# Altium project ESP32.PrjPcb
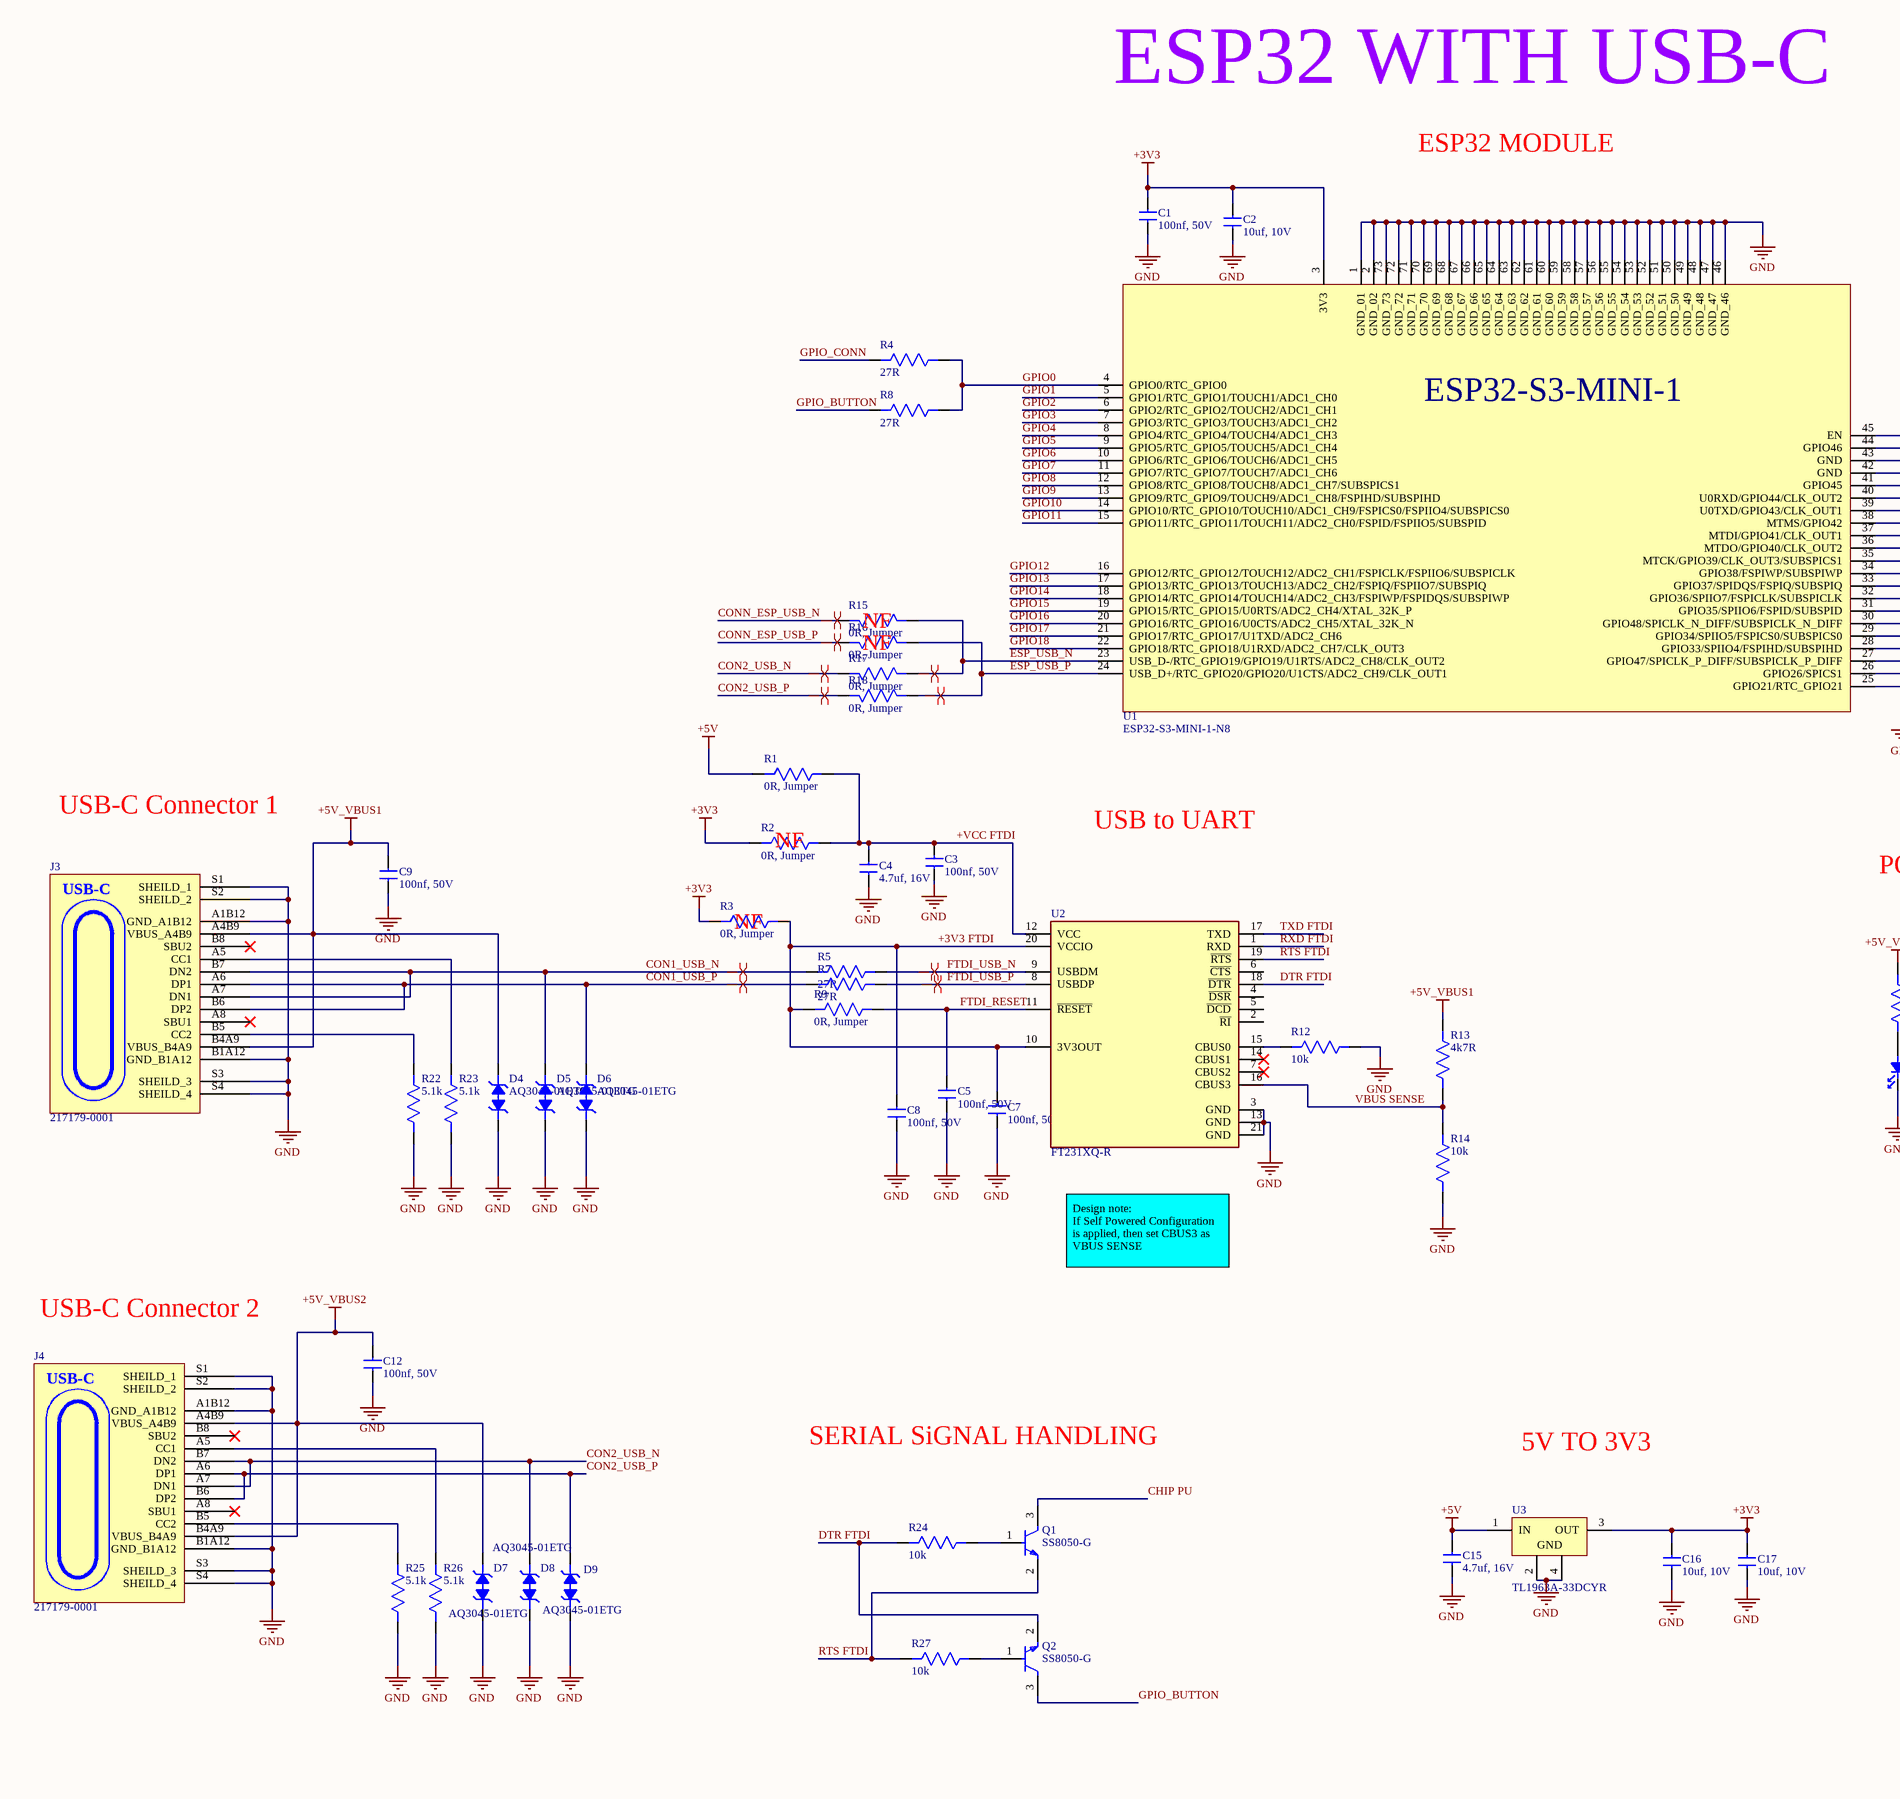
[diagram p0: ESP32_USBC.SchDoc, left]
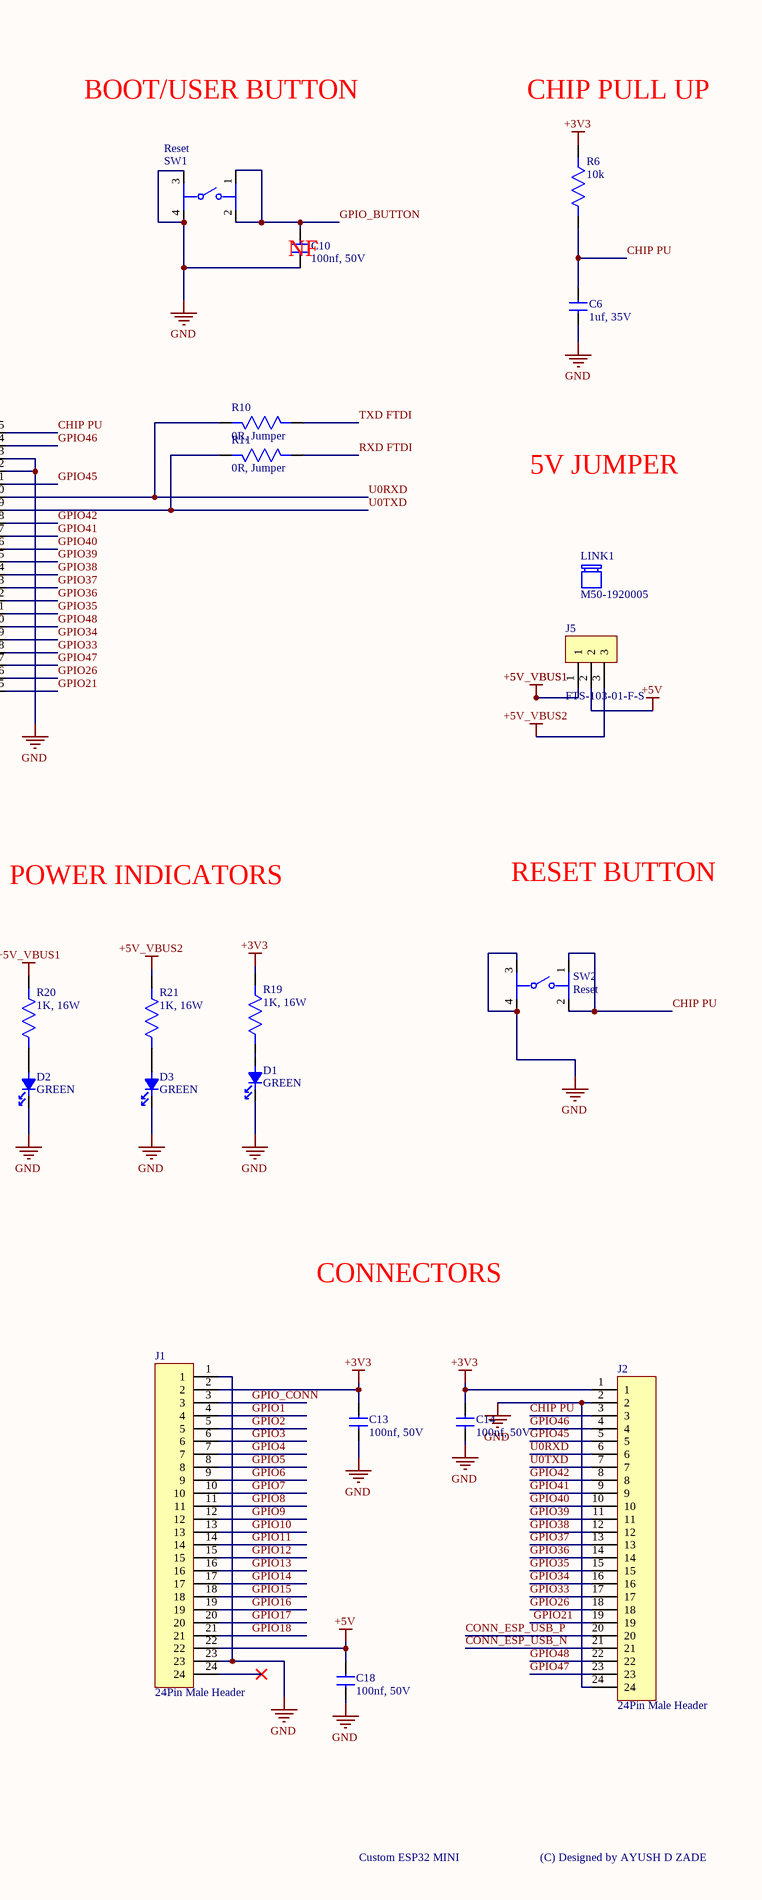
[diagram p1: ESP32_USBC.SchDoc, right]
1 sheet, 66 parts. Net scope: global (net labels, ports and power ports of the same name join across sheets).
Board file: ESP32_USBCv1.PcbDoc

## Sheet ESP32_USBC.SchDoc
size A2; SheetNumber: 1; SheetTotal: 1

### Parts
C1  100nf, 50V  [CAPC1005X70N]
C2  10uf, 10V  [CAPC1005X70N]
C3  100nf, 50V  [CAPC1005X70N]
C4  4.7uf, 16V  [CAPC1005X70N]
C5  100nf, 50V  [CAPC1005X70N]
C6  1uf, 35V  [CAPC1005X70N]
C7  100nf, 50V  [CAPC1005X70N]
C8  100nf, 50V  [CAPC1005X70N]
C9  100nf, 50V  [CAPC1005X70N]
C10  100nf, 50V  [CAPC1005X70N]
C12  100nf, 50V  [CAPC1005X70N]
C13  100nf, 50V  [CAPC1005X70N]
C14  100nf, 50V  [CAPC1005X70N]
C15  4.7uf, 16V  [CAPC1005X70N]
C16  10uf, 10V  [CAPC1005X70N]
C17  10uf, 10V  [CAPC1005X70N]
C18  100nf, 50V  [CAPC1005X70N]
D1  GREEN  [LEDC1005X35N]
D2  GREEN  [LEDC1005X35N]
D3  GREEN  [LEDC1005X35N]
D4  AQ3045-01ETG  [SOD882]
D5  AQ3045-01ETG  [SOD882]
D6  AQ3045-01ETG  [SOD882]
D7  AQ3045-01ETG  [SOD882]
D8  AQ3045-01ETG  [SOD882]
D9  AQ3045-01ETG  [SOD882]
J1  24Pin Male Header  [HDR_01x24_2.54mm]
J2  24Pin Male Header  [HDR_01x24_2.54mm]
J3  217179-0001  [FP-2171790001-MFG]
J4  217179-0001  [FP-2171790001-MFG]
J5  FTS-103-01-F-S  [HDR_01x03_1.27]
LINK1  M50-1920005  (mechanical)
Q1  SS8050-G  [FP-SS8050-G-IPC_B]
Q2  SS8050-G  [FP-SS8050-G-IPC_B]
R1  0R, Jumper  [RESC1005X37N]
R2  0R, Jumper  [RESC1005X37N]
R3  0R, Jumper  [RESC1005X37N]
R4  27R  [RESC1005X37N]
R5  27R  [RESC1005X37N]
R6  10k  [RESC1005X37N]
R7  27R  [RESC1005X37N]
R8  27R  [RESC1005X37N]
R9  0R, Jumper  [RESC1005X37N]
R10  0R, Jumper  [RESC1005X37N]
R11  0R, Jumper  [RESC1005X37N]
R12  10k  [RESC1005X37N]
R13  4k7R  [RESC1005X37N]
R14  10k  [RESC1005X37N]
R15  0R, Jumper  [RESC1005X37N]
R16  0R, Jumper  [RESC1005X37N]
R17  0R, Jumper  [RESC1005X37N]
R18  0R, Jumper  [RESC1005X37N]
R19  1K, 16W  [RESC1005X37N]
R20  1K, 16W  [RESC1005X37N]
R21  1K, 16W  [RESC1005X37N]
R22  5.1k  [RESC1005X37N]
R23  5.1k  [RESC1005X37N]
R24  10k  [RESC1005X37N]
R25  5.1k  [RESC1005X37N]
R26  5.1k  [RESC1005X37N]
R27  10k  [RESC1005X37N]
SW1  Reset  [FP-PTS645SH50SMTR92LFS-MFG]
SW2  Reset  [FP-PTS645SH50SMTR92LFS-MFG]
U1  ESP32-S3-MINI-1-N8  [XCVR_ESP32-S3-MINI-1-N8]
U2  FT231XQ-R  [FP-QFN-20-IPC_B]
U3  TL1963A-33DCYR  [DCY0004A_N]

### Nets
+3V3: C1.2 C2.2 C13.2 C14.2 C16.2 C17.2 J1.2 J2.1 R2.1 R3.1 R6.2 R19.2 U1.3(3V3) U3.3(OUT)
+5V: C15.2 C18.2 J1.22 J5.2 R1.1 U3.1(IN)
+5V_VBUS1: C9.2 D4.2 J3.A4B9(VBUS_A4B9) J3.B4A9(VBUS_B4A9) J5.1 R13.2 R20.2
+5V_VBUS2: C12.2 D7.2 J4.A4B9(VBUS_A4B9) J4.B4A9(VBUS_B4A9) J5.3 R21.2
GND: C1.1 C2.1 C3.1 C4.1 C5.1 C6.1 C7.1 C8.1 C9.1 C10.2 C12.1 C13.1 C14.1 C15.1 C16.1 C17.1 C18.1 D1.1 D2.1 D3.1 D4.1 D5.1 D6.1 D7.1 D8.1 D9.1 J1.1 J1.23 J2.2 J2.24 J3.A1B12(GND_A1B12) J3.B1A12(GND_B1A12) J3.S1(SHEILD_1) J3.S2(SHEILD_2) J3.S3(SHEILD_3) J3.S4(SHEILD_4) J4.A1B12(GND_A1B12) J4.B1A12(GND_B1A12) J4.S1(SHEILD_1) J4.S2(SHEILD_2) J4.S3(SHEILD_3) J4.S4(SHEILD_4) R12.2 R14.1 R22.2 R23.2 R25.2 R26.2 SW1.3 SW1.4 SW2.3 SW2.4 U1.1(GND_01) U1.2(GND_02) U1.42(GND) U1.43(GND) U1.46(GND_46) U1.47(GND_47) U1.48(GND_48) U1.49(GND_49) U1.50(GND_50) U1.51(GND_51) U1.52(GND_52) U1.53(GND_53) U1.54(GND_54) U1.55(GND_55) U1.56(GND_56) U1.57(GND_57) U1.58(GND_58) U1.59(GND_59) U1.60(GND_60) U1.61(GND_61) U1.62(GND_62) U1.63(GND_63) U1.64(GND_64) U1.65(GND_65) U1.66(GND_66) U1.67(GND_67) U1.68(GND_68) U1.69(GND_69) U1.70(GND_70) U1.71(GND_71) U1.72(GND_72) U1.73(GND_73) U2.3(GND) U2.13(GND) U2.21(GND) U3.2(GND) U3.4(GND)
+3V3 FTDI: C7.2 C8.2 R3.2 R9.1 U2.10(3V3OUT) U2.20(VCCIO)
+VCC FTDI: C3.2 C4.2 R1.2 R2.2 U2.12(VCC)
CHIP PU: C6.2 J2.3 Q1.3(C) R6.1 SW2.1 SW2.2 U1.45(EN)
CON1_USB_N: D5.2 J3.A7(DN1) J3.B7(DN2) R5.1
CON1_USB_P: D6.2 J3.A6(DP1) J3.B6(DP2) R7.1
CON2_USB_N: D8.2 J4.A7(DN1) J4.B7(DN2) R17.2
CON2_USB_P: D9.2 J4.A6(DP1) J4.B6(DP2) R18.2
CONN_ESP_USB_N: J2.21 R15.2
CONN_ESP_USB_P: J2.20 R16.2
DTR FTDI: Q2.2(E) R24.1 U2.18(~{DTR})
ESP_USB_N: R15.1 R17.1 U1.23(USB_D-/RTC_GPIO19/GPIO19/U1RTS/ADC2_CH8/CLK_OUT2)
ESP_USB_P: R16.1 R18.1 U1.24(USB_D+/RTC_GPIO20/GPIO20/U1CTS/ADC2_CH9/CLK_OUT1)
FTDI_RESET: C5.2 R9.2 U2.11(~{RESET})
FTDI_USB_N: R5.2 U2.9(USBDM)
FTDI_USB_P: R7.2 U2.8(USBDP)
GPIO0: R4.2 R8.2 U1.4(GPIO0/RTC_GPIO0)
GPIO1: J1.4 U1.5(GPIO1/RTC_GPIO1/TOUCH1/ADC1_CH0)
GPIO2: J1.5 U1.6(GPIO2/RTC_GPIO2/TOUCH2/ADC1_CH1)
GPIO3: J1.6 U1.7(GPIO3/RTC_GPIO3/TOUCH3/ADC1_CH2)
GPIO4: J1.7 U1.8(GPIO4/RTC_GPIO4/TOUCH4/ADC1_CH3)
GPIO5: J1.8 U1.9(GPIO5/RTC_GPIO5/TOUCH5/ADC1_CH4)
GPIO6: J1.9 U1.10(GPIO6/RTC_GPIO6/TOUCH6/ADC1_CH5)
GPIO7: J1.10 U1.11(GPIO7/RTC_GPIO7/TOUCH7/ADC1_CH6)
GPIO8: J1.11 U1.12(GPIO8/RTC_GPIO8/TOUCH8/ADC1_CH7/SUBSPICS1)
GPIO9: J1.12 U1.13(GPIO9/RTC_GPIO9/TOUCH9/ADC1_CH8/FSPIHD/SUBSPIHD)
GPIO10: J1.13 U1.14(GPIO10/RTC_GPIO10/TOUCH10/ADC1_CH9/FSPICS0/FSPIIO4/SUBSPICS0)
GPIO11: J1.14 U1.15(GPIO11/RTC_GPIO11/TOUCH11/ADC2_CH0/FSPID/FSPIIO5/SUBSPID)
GPIO12: J1.15 U1.16(GPIO12/RTC_GPIO12/TOUCH12/ADC2_CH1/FSPICLK/FSPIIO6/SUBSPICLK)
GPIO13: J1.16 U1.17(GPIO13/RTC_GPIO13/TOUCH13/ADC2_CH2/FSPIQ/FSPIIO7/SUBSPIQ)
GPIO14: J1.17 U1.18(GPIO14/RTC_GPIO14/TOUCH14/ADC2_CH3/FSPIWP/FSPIDQS/SUBSPIWP)
GPIO15: J1.18 U1.19(GPIO15/RTC_GPIO15/U0RTS/ADC2_CH4/XTAL_32K_P)
GPIO16: J1.19 U1.20(GPIO16/RTC_GPIO16/U0CTS/ADC2_CH5/XTAL_32K_N)
GPIO17: J1.20 U1.21(GPIO17/RTC_GPIO17/U1TXD/ADC2_CH6)
GPIO18: J1.21 U1.22(GPIO18/RTC_GPIO18/U1RXD/ADC2_CH7/CLK_OUT3)
GPIO21: J2.19 U1.25(GPIO21/RTC_GPIO21)
GPIO26: J2.18 U1.26(GPIO26/SPICS1)
GPIO33: J2.17 U1.28(GPIO33/SPIIO4/FSPIHD/SUBSPIHD)
GPIO34: J2.16 U1.29(GPIO34/SPIIO5/FSPICS0/SUBSPICS0)
GPIO35: J2.15 U1.31(GPIO35/SPIIO6/FSPID/SUBSPID)
GPIO36: J2.14 U1.32(GPIO36/SPIIO7/FSPICLK/SUBSPICLK)
GPIO37: J2.13 U1.33(GPIO37/SPIDQS/FSPIQ/SUBSPIQ)
GPIO38: J2.12 U1.34(GPIO38/FSPIWP/SUBSPIWP)
GPIO39: J2.11 U1.35(MTCK/GPIO39/CLK_OUT3/SUBSPICS1)
GPIO40: J2.10 U1.36(MTDO/GPIO40/CLK_OUT2)
GPIO41: J2.9 U1.37(MTDI/GPIO41/CLK_OUT1)
GPIO42: J2.8 U1.38(MTMS/GPIO42)
GPIO45: J2.5 U1.41(GPIO45)
GPIO46: J2.4 U1.44(GPIO46)
GPIO47: J2.23 U1.27(GPIO47/SPICLK_P_DIFF/SUBSPICLK_P_DIFF)
GPIO48: J2.22 U1.30(GPIO48/SPICLK_N_DIFF/SUBSPICLK_N_DIFF)
GPIO_BUTTON: C10.1 Q2.3(C) R8.1 SW1.1 SW1.2
GPIO_CONN: J1.3 R4.1
RTS FTDI: Q1.2(E) R27.1 U2.19(~{RTS})
RXD FTDI: R11.1 U2.1(RXD)
TXD FTDI: R10.1 U2.17(TXD)
U0RXD: J2.6 R10.2 U1.40(U0RXD/GPIO44/CLK_OUT2)
U0TXD: J2.7 R11.2 U1.39(U0TXD/GPIO43/CLK_OUT1)
VBUS SENSE: R13.1 R14.2 U2.16(CBUS3)
NetD1_2: D1.2 R19.1
NetD2_2: D2.2 R20.1
NetD3_2: D3.2 R21.1
NetJ3_A5: J3.A5(CC1) R23.1
NetJ3_B5: J3.B5(CC2) R22.1
NetJ4_A5: J4.A5(CC1) R26.1
NetJ4_B5: J4.B5(CC2) R25.1
NetQ1_1: Q1.1(B) R24.2
NetQ2_1: Q2.1(B) R27.2
NetR12_1: R12.1 U2.15(CBUS0)

Not connected (* = marked no-connect by the designer): J1 24*; J3 A8(SBU1)* B8(SBU2)*; J4 A8(SBU1)* B8(SBU2)*; U2 2(~{RI}) 4(~{DSR}) 5(~{DCD}) 6(~{CTS}) 7(CBUS2)* 14(CBUS1)*

### Layout directives
differential pair; differential pair class DIFF90: CON1_USB_N, CON1_USB_P, CON2_USB_N, CON2_USB_P, CONN_ESP_USB_N, CONN_ESP_USB_P, ESP_USB_N, ESP_USB_P, FTDI_USB_N, FTDI_USB_P

### Notes on the sheet
- ESP32 WITH USB-C
- BOOT/USER BUTTON
- CHIP PULL UP
- ESP32 MODULE
- (near C10) NF
- 5V JUMPER
- (near R15) NF
- (near R16) NF
- USB-C Connector 1
- (near R2) NF
- USB to UART
- POWER INDICATORS
- RESET BUTTON
- (near R3) NF
- Design note:
  If Self Powered Configuration is applied, then set CBUS3 as VBUS SENSE
- CONNECTORS
- USB-C Connector 2
- SERIAL SiGNAL HANDLING
- 5V TO 3V3
- Custom ESP32 MINI
- (C) Designed by AYUSH D ZADE
- (in symbol 217179-0001) USB-C
- (in symbol ESP32-S3-MINI-1-N8) ESP32-S3-MINI-1

### Library data of the parts
C1 C3 C5 C7-C10 C12-C14 C18 = CL05B104KB5NNWC: CAP CER 0.1UF 50V X7R 0402; Manufacturer: Samsung Electro-Mechanics; Dielectric Material: Ceramic; Supplier: DigiKey; Supplier Part Number: 1276-CL05B104KB5NNWCDKR-ND; Manufacturer Part Number: CL05B104KB5NNWC; RoHS: Compliant; Category: Ceramic Capacitors; Stock: 37619; Pricing: 1=0.1, 10=0.054, 100=0.0322, 1000=0.02094, 2500=0.01816, 5000=0.01649 (USD); Value: 100nF; China RoHS: Compliant; Lifecycle Status: Production; Max Operating Temperature: 125°C; Min Operating Temperature: -55°C; Mounting Technology: Surface Mount; Number of Terminals: 2; REACH SVHC: Yes; Schedule B: 8532240020, 8532240020|8532240020|8532240020|8532240020|8532240020; Voltage Rating (DC): 50V; ComponentLink1URL: https://datasheet.octopart.com:443/CL05B104KB5NNWC-Samsung-Electro-Mechanics-datasheet-182018729.pdf?src-supplier=IHS; ComponentLink1Description: https://datasheet.octopart.com:443/CL05B104KB5NNWC-Samsung-Electro-Mechanics-datasheet-182018729.pdf?src-supplier=IHS; LCSC Part No.: C7229230
C2 C16 C17 = CL05A106MP5NRNC: CAP CER 10UF 10V X5R 0402; Manufacturer: Samsung Electro-Mechanics; Value: 10µF; Dielectric Material: Ceramic; Tolerance: 20%; Supplier: DigiKey; Supplier Part Number: 1276-CL05A106MP5NRNCCT-ND; Manufacturer Part Number: CL05A106MP5NRNC; RoHS: Compliant; Category: Ceramic Capacitors; Stock: 49277; Pricing: 1=0.24, 10=0.141, 100=0.0894, 1000=0.06284, 2500=0.05624, 5000=0.05227 (USD); Case/Package: 0402; China RoHS: Compliant; Height: 550µm; Lifecycle Status: NRND; Material: Ceramic; Max Operating Temperature: 85°C; Min Operating Temperature: -55°C; Mounting Technology: Surface Mount; Number of Terminals: 2; REACH SVHC: Yes; Voltage Rating: 10V; Voltage Rating (DC): 10V; ComponentLink1URL: https://datasheet.octopart.com:443/CL05A106MP5NRNC-Samsung-Electro-Mechanics-datasheet-182018592.pdf?src-supplier=IHS; ComponentLink1Description: https://datasheet.octopart.com:443/CL05A106MP5NRNC-Samsung-Electro-Mechanics-datasheet-182018592.pdf?src-supplier=IHS; ComponentLink2URL: https://datasheet.octopart.com:443/CL05A106MP5NRNC-Samsung-Electro-Mechanics-datasheet-141346812.pdf?src-supplier=Samsung+SCT; ComponentLink2Description: https://datasheet.octopart.com:443/CL05A106MP5NRNC-Samsung-Electro-Mechanics-datasheet-141346812.pdf?src-supplier=Samsung+SCT; LCSC Part No.: C3035383
C4 C15 = CL05A475MO5NUNC: 4.7 µF ±20% 16V Ceramic Capacitor X5R 0402 (1005 Metric); Manufacturer: Samsung; Multilayer: Yes; Supplier: Digikey; Supplier Part Number: 1276-6836-1-ND; Manufacturer Part Number: CL05A475MO5NUNC; RoHS: Yes; Category: Ceramic Capacitors; Pricing: 1=0.15, 10=0.091, 100=0.0842 (USD); Mounting Technology: Surface Mount; Pins: 2; Dielectric Material: Ceramic; Package Shape: Rectangular; Case/Package: 0402; Terminal Finish: Nickel; Min Operating Temperature: -55°C; Max Operating Temperature: 85°C; JESD-609 Code: e3; Value: 4.7uF; Capacitor Type: Ceramic; Tolerance  (fill in as +-): 20%; Package Style: SMTMeter; Packaging: Tape and Reel; Tolerance (fill in as +-): 20%; Rated DC Voltage (URdc): 16V; Temperature Characteristics Code: X5R; Termination: Wraparound; Length: 1mm; Width: 0.5mm; Height: 0.7mm; Reach SVHC Compliant: Yes; RoHS Compliant: Yes; ComponentLink1URL: https://datasheet.ciiva.com:443/pdfs/VipMasterIC/IC/SEMS/SEMS-S-A0008384515/SEMS-S-A0008898881-1.pdf?src-supplier=IHS+Markit; ComponentLink1Description: https://datasheet.ciiva.com:443/pdfs/VipMasterIC/IC/SEMS/SEMS-S-A0008384515/SEMS-S-A0008898881-1.pdf?src-supplier=IHS+Markit; ComponentLink2URL: http://www.farnell.com/datasheets/2710653.pdf?src-supplier=Farnell; ComponentLink2Description: http://www.farnell.com/datasheets/2710653.pdf?src-supplier=Farnell; ComponentLink3URL: http://www.samsungsem.com/kr/support/product-search/mlcc/CL05A475MO5NUNC.jsp?src-supplier=Digikey; ComponentLink3Description: http://www.samsungsem.com/kr/support/product-search/mlcc/CL05A475MO5NUNC.jsp?src-supplier=Digikey; ComponentLink4URL: http://www.farnell.com/datasheets/2710653.pdf?src-supplier=Newark; ComponentLink4Description: http://www.farnell.com/datasheets/2710653.pdf?src-supplier=Newark; ComponentLink5URL: http://www.farnell.com/datasheets/2710653.pdf?src-supplier=Element14; ComponentLink5Description: http://www.farnell.com/datasheets/2710653.pdf?src-supplier=Element14; ComponentLink6URL: https://datasheet.octopart.com/CL05A475MO5NUNC-Samsung-Electro-Mechanics-datasheet-123102911.pdf?src-supplier=Future+Electronics; ComponentLink6Description: https://datasheet.octopart.com/CL05A475MO5NUNC-Samsung-Electro-Mechanics-datasheet-123102911.pdf?src-supplier=Future+Electronics; LCSC Part No.: C318563
C6 = CL05A105KL5NRNC: CAP CER 1UF 35V X5R 0402; Manufacturer: Samsung Electro-Mechanics; Value: 1µF; Dielectric Material: Ceramic; Tolerance: 10%; Supplier: DigiKey; Supplier Part Number: 1276-6796-1-ND; Manufacturer Part Number: CL05A105KL5NRNC; RoHS: Compliant; Category: Ceramic Capacitors; Stock: 53917; Pricing: 1=0.29, 10=0.17, 100=0.1097, 1000=0.07829, 2500=0.07048, 5000=0.06578 (USD); Case/Package: 0402; Case Code (Imperial): 0402; Case Code (Metric): 1005; China RoHS: Compliant; Height: 550µm; Length: 990.6µm; Lifecycle Status: Production; Material: Ceramic; Max Operating Temperature: 85°C; Min Operating Temperature: -55°C; Mounting Technology: Surface Mount; Number of Terminals: 2; REACH SVHC: Yes; Schedule B: 8532240020, 8532240020|8532240020|8532240020|8532240020|8532240020; Thickness: 558.8µm; Voltage Rating: 35V; Voltage Rating (DC): 35V; Width: 508µm; ComponentLink1URL: https://datasheet.octopart.com:443/CL05A105KL5NRNC-Samsung-Electro-Mechanics-datasheet-182018568.pdf?src-supplier=IHS; ComponentLink1Description: https://datasheet.octopart.com:443/CL05A105KL5NRNC-Samsung-Electro-Mechanics-datasheet-182018568.pdf?src-supplier=IHS; ComponentLink2URL: https://datasheet.octopart.com:443/CL05A105KL5NRNC-Samsung-Electro-Mechanics-datasheet-141346806.pdf?src-supplier=Samsung+SCT; ComponentLink2Description: https://datasheet.octopart.com:443/CL05A105KL5NRNC-Samsung-Electro-Mechanics-datasheet-141346806.pdf?src-supplier=Samsung+SCT; ComponentLink3URL: https://datasheet.octopart.com:443/CL05A105KL5NRNC-Samsung-datasheet-8326407.pdf?src-supplier=TME; ComponentLink3Description: https://datasheet.octopart.com:443/CL05A105KL5NRNC-Samsung-datasheet-8326407.pdf?src-supplier=TME; LCSC Part No.: C307413
D1-D3 = VLMG1500-GS08: LED YLW-GRN 0402 SMD; Manufacturer: Vishay; Color: Green,Yellow; Shape: Rectangular; Forward Current: 30mA; Forward Voltage: 2.4V; Luminous Intensity-Nom: 90mcd; Channels: 1; Optoelectronic Device Type: SINGLE COLOR LED; Reverse Voltage-Max: 5V; Viewing Angle: 130°; Overall Height: 0.35mm; Supplier: Digikey; Supplier Part Number: VLMG1500-GS08CT-ND; Manufacturer Part Number: VLMG1500-GS08; RoHS: Yes; Category: LEDs; Stock: 234660; Pricing: 1=0.24, 10=0.164, 100=0.1147, 500=0.09218, 1000=0.0847 (USD); Mounting Technology: Surface Mount; Pins: 2; Color@wavelength: Green; Min Operating Temperature: -30°C; Max Operating Temperature: 85°C; Packaging: Tape and Reel; Size: 0.5mm; Terminal Pitch: 0.95mm; Reach SVHC Compliant: Yes; RoHS Compliant: Yes; ComponentLink1URL: https://datasheet.ciiva.com:443/pdfs/VipMasterIC/IC/VISH/VISH-S-A0003457490/VISH-S-A0003457490-1.pdf?src-supplier=IHS+Markit; ComponentLink1Description: https://datasheet.ciiva.com:443/pdfs/VipMasterIC/IC/VISH/VISH-S-A0003457490/VISH-S-A0003457490-1.pdf?src-supplier=IHS+Markit; ComponentLink2URL: https://datasheet.ciiva.com/12071/vlmo1500-244705-12071911.pdf?src-supplier=Mouser; ComponentLink2Description: https://datasheet.ciiva.com/12071/vlmo1500-244705-12071911.pdf?src-supplier=Mouser; ComponentLink3URL: https://datasheet.ciiva.com/30005/vlmo1500-30005134.pdf?src-supplier=Avnet; ComponentLink3Description: https://datasheet.ciiva.com/30005/vlmo1500-30005134.pdf?src-supplier=Avnet; LCSC Part No.: C511404
D4-D9 = AQ3045-01ETG: TVS DIODE 5.3VWM 12VC SOD882; Manufacturer: Littelfuse; Diode Element Material: SILICON; Package Body Material: Plastic; Polarity: Bidirectional; Max Breakdown Voltage: 9V; Min Breakdown Voltage: 6.8V; Diode Type: TRANS VOLTAGE SUPPRESSOR; Non-rep Peak Rev Power Dis-Max: 40W; Number of Elements: 1; Rep Pk Reverse Voltage-Max: 5.3V; Reference Standard: AEC-Q101; Supplier: Digikey; Supplier Part Number: F9321CT-ND; Manufacturer Part Number: AQ3045-01ETG; RoHS: Yes; Category: TVS Diodes; Stock: 7460; Pricing: 1=0.45, 10=0.29, 100=0.141, 500=0.134, 1000=0.131 (USD); Pins: 2; Package Shape: Rectangular; Min Operating Temperature: -55°C; Max Operating Temperature: 150°C; Package Style: CHIP CARRIERMeter; Surface Mount: Yes; Technology: AVALANCHE; Terminal Form: No Lead; Terminal Position: BOTTOM; Reach SVHC Compliant: Yes; RoHS Compliant: Yes; ComponentLink1URL: https://datasheet.ciiva.com:443/pdfs/VipMasterIC/IC/LFSI/LFSI-S-A0007892042/LFSI-S-A0007892042-1.pdf?src-supplier=IHS+Markit; ComponentLink1Description: https://datasheet.ciiva.com:443/pdfs/VipMasterIC/IC/LFSI/LFSI-S-A0007892042/LFSI-S-A0007892042-1.pdf?src-supplier=IHS+Markit; ComponentLink2URL: https://www.littelfuse.com/~/media/electronics/datasheets/tvs_diode_arrays/littelfuse_tvs_diode_array_aq3045_datasheet.pdf.pdf?src-supplier=Digikey; ComponentLink2Description: https://www.littelfuse.com/~/media/electronics/datasheets/tvs_diode_arrays/littelfuse_tvs_diode_array_aq3045_datasheet.pdf.pdf?src-supplier=Digikey; ComponentLink3URL: http://www.littelfuse.com/~/media/electronics/datasheets/tvs_diode_arrays/littelfuse_tvs_diode_array_aq3045_datasheet.pdf.pdf?src-supplier=Digikey; ComponentLink3Description: http://www.littelfuse.com/~/media/electronics/datasheets/tvs_diode_arrays/littelfuse_tvs_diode_array_aq3045_datasheet.pdf.pdf?src-supplier=Digikey; LCSC Part No.: C3710326
J1 J2 = 0022284245: CONN HEADER VERT 24POS 2.54MM; Manufacturer: Molex; Supplier: Digikey; Supplier Part Number: 900-0022284245-ND; Manufacturer Part Number: 22-28-4245; RoHS: No; Category: Headers and Wire Housings; Stock: 1546; Pricing: 1=1.21, 10=1.024, 100=0.8699, 500=0.77638, 1000=0.73932, 5000=0.65998, 10000=0.62851 (USD); ComponentLink1URL: https://datasheet.ciiva.com/6814/022284363-sd-6814049.pdf?src-supplier=Digikey; ComponentLink1Description: https://datasheet.ciiva.com/6814/022284363-sd-6814049.pdf?src-supplier=Digikey; ComponentLink2URL: https://datasheet.ciiva.com/10075/0022284245-pcb-headers-10075617.pdf?src-supplier=Avnet; ComponentLink2Description: https://datasheet.ciiva.com/10075/0022284245-pcb-headers-10075617.pdf?src-supplier=Avnet; ComponentLink3URL: https://datasheet.ciiva.com/1433/1597854-1433759.pdf?src-supplier=Element14; ComponentLink3Description: https://datasheet.ciiva.com/1433/1597854-1433759.pdf?src-supplier=Element14; LCSC Part No.: C7145888
J3 J4 = 217179-0001: CONN RCP USB2.0 TYP C 24P SMD RA; Manufacturer: Molex; Supplier: Digikey; Supplier Part Number: 900-2171790001CT-ND; Manufacturer Part Number: 217179-0001; RoHS: No; Category: Connectors; Stock: 19261; Pricing: 1=0.83, 10=0.704, 25=0.6596, 50=0.628, 100=0.598, 250=0.56052, 500=0.53374 (USD); LCSC Part No.: C3197684
J5 = FTS-103-01-F-S: CONN HEADER VERT 3POS 1.27MM; Manufacturer: Samtec; Manufacturer Series: FTS; Connector Type: BOARD CONNECTOR; Option: General Purpose; Additional Feature: Low Profile; Filter Feature: No; Number of Rows Loaded: 1; Number of Contacts: 3; Supplier: Digikey; Supplier Part Number: 612-FTS-103-01-F-S-ND; Manufacturer Part Number: FTS-103-01-F-S; RoHS: Yes; Category: Connectors; Stock: 679; Pricing: 1=0.73, 50=0.6378, 100=0.5407, 500=0.4491, 1000=0.384 (USD); Mounting Technology: Board; Contact Material: Bronze; Contact Finish - Mating: GOLD (3) OVER NICKEL (50); Contact Finish - Termination: Matte Tin (Sn) - with Nickel (Ni) barrier; JESD-609 Code: e3; Contact Gender: Male; Mixed Contacts: No; Mounting Style: STRAIGHT; Termination: Solder; Terminal Pitch: 1.27mm; Flammability Rating: UL94 V-0; DIN Conformance: No; IEC Conformance: No; MIL Conformance: No; Reach SVHC Compliant: Yes; RoHS Compliant: Yes; ComponentLink1URL: https://datasheet.ciiva.com:443/pdfs/VipMasterIC/IC/SAMI/SAMI-S-A0001504673/SAMI-S-A0001504673-1.pdf?src-supplier=IHS+Markit; ComponentLink1Description: https://datasheet.ciiva.com:443/pdfs/VipMasterIC/IC/SAMI/SAMI-S-A0001504673/SAMI-S-A0001504673-1.pdf?src-supplier=IHS+Markit; ComponentLink2URL: http://suddendocs.samtec.com/prints/fts-1xx-xx-xx-xx-xx-mkt.pdf?src-supplier=Digikey; ComponentLink2Description: http://suddendocs.samtec.com/prints/fts-1xx-xx-xx-xx-xx-mkt.pdf?src-supplier=Digikey; ComponentLink3URL: http://www.samtec.com/documents/webfiles/pdf/FTS.pdf?src-supplier=Avnet; ComponentLink3Description: http://www.samtec.com/documents/webfiles/pdf/FTS.pdf?src-supplier=Avnet; ComponentLink4URL: https://datasheet.octopart.com/FTS-103-01-F-S-Samtec-datasheet-116535195.pdf?src-supplier=Toby+Electronics; ComponentLink4Description: https://datasheet.octopart.com/FTS-103-01-F-S-Samtec-datasheet-116535195.pdf?src-supplier=Toby+Electronics; ComponentLink5URL: https://datasheet.octopart.com/FTS-103-01-F-S-Samtec-datasheet-151470456.pdf?src-supplier=Sager+Electronics; ComponentLink5Description: https://datasheet.octopart.com/FTS-103-01-F-S-Samtec-datasheet-151470456.pdf?src-supplier=Sager+Electronics; ComponentLink6URL: https://datasheet.octopart.com/FTS-103-01-F-S-Samtec-datasheet-118493358.pdf?src-supplier=Electro+Sonic; ComponentLink6Description: https://datasheet.octopart.com/FTS-103-01-F-S-Samtec-datasheet-118493358.pdf?src-supplier=Electro+Sonic; LCSC Part No.: C3333578
LINK1 = M50-1920005: CONN SHUNT 1.27MM RED; Manufacturer: Harwin; Manufacturer Series: M50; Connector Type: Interconnection Device; Body/Shell Style: PLUG; Contact Pattern: RECTANGULAR; Contact Resistance: 20mR; Dielectric Withstanding Voltage (AC): 500V; Durability: 300Cycles; Insulation Resistance: 1GR; Number Of Connectors: 1; Rated Current (Signal): 1A; Number of Contacts: 2; Body Breadth: 0.059inch; Body Depth: 0.118inch; Body Length: 0.098inch; Mating Contact Pitch: 0.05inch; Reference Standard: UL; Reliability: COMMERCIAL; Supplier: Digikey; Supplier Part Number: 952-1727-ND; Manufacturer Part Number: M50-1920005; RoHS: Yes; Category: Headers and Wire Housings; Stock: 4313; Pricing: 1=0.33, 10=0.284, 25=0.2664, 50=0.2536, 100=0.2414, 250=0.22628, 500=0.21546, 1000=0.20516, 3000=0.18984 (USD); Contact Material: Copper Alloy; Contact Finish - Mating: AU ON NI; Contact Finish - Termination: Gold (Au); Insulation Color: Red; Insulation Material: Nylon; Min Operating Temperature: -40°C; Max Operating Temperature: 105°C; JESD-609 Code: e4; Contact Gender: Female; Mounting Style: STRAIGHT; Number of Rows Loaded: 1; Reach SVHC Compliant: Yes; RoHS Compliant: Yes; ComponentLink1URL: https://datasheet.ciiva.com:443/pdfs/VipMasterIC/IC/HRWN/HRWNS04645/HRWNS04645-1.pdf?src-supplier=IHS+Markit; ComponentLink1Description: https://datasheet.ciiva.com:443/pdfs/VipMasterIC/IC/HRWN/HRWNS04645/HRWNS04645-1.pdf?src-supplier=IHS+Markit; ComponentLink2URL: https://datasheet.ciiva.com/4573/m50-19x-350826-4573042.pdf?src-supplier=Mouser; ComponentLink2Description: https://datasheet.ciiva.com/4573/m50-19x-350826-4573042.pdf?src-supplier=Mouser; ComponentLink3URL: https://datasheet.ciiva.com/767/m50-19x-767921.pdf?src-supplier=Digikey; ComponentLink3Description: https://datasheet.ciiva.com/767/m50-19x-767921.pdf?src-supplier=Digikey; ComponentLink4URL: https://datasheet.ciiva.com/1456/m50-19x-1456640.pdf?src-supplier=Newark; ComponentLink4Description: https://datasheet.ciiva.com/1456/m50-19x-1456640.pdf?src-supplier=Newark; ComponentLink5URL: https://datasheet.ciiva.com/1412/1836978-1412125.pdf?src-supplier=Element14; ComponentLink5Description: https://datasheet.ciiva.com/1412/1836978-1412125.pdf?src-supplier=Element14; LCSC Part No.: C6985646
Q1 Q2 = SS8050-G: TRANS NPN 25V 1.5A SOT-23-3; Manufacturer: Comchip; Supplier: Digikey; Supplier Part Number: 641-1790-1-ND; Manufacturer Part Number: SS8050-G; RoHS: Yes; Category: Transistors; Stock: 81671; Pricing: 1=0.24, 10=0.148, 100=0.0921, 500=0.06754, 1000=0.05958 (USD); Reach SVHC Compliant: Yes; RoHS Compliant: Yes; ComponentLink1URL: https://datasheet.ciiva.com:443/pdfs/VipMasterIC/IC/COMC/COMC-S-A0004994192/COMC-S-A0004994192-1.pdf?src-supplier=IHS+Markit; ComponentLink1Description: https://datasheet.ciiva.com:443/pdfs/VipMasterIC/IC/COMC/COMC-S-A0004994192/COMC-S-A0004994192-1.pdf?src-supplier=IHS+Markit; ComponentLink2URL: http://www.comchiptech.com/admin/files/product/SS8050-G RevA181526.pdf?src-supplier=Digikey; ComponentLink2Description: http://www.comchiptech.com/admin/files/product/SS8050-G RevA181526.pdf?src-supplier=Digikey; LCSC Part No.: C164886
R1-R3 R9-R11 R15-R18 = RC0402FR-070RL: RES 0 OHM JUMPER 1/16W 0402; Manufacturer: Yageo; Power: 62.5mW; Rated Temperature: 70°C; Supplier: Digikey; Supplier Part Number: 311-0.0LRCT-ND; Manufacturer Part Number: RC0402FR-070RL; RoHS: Yes; Category: Chip SMD Resistors; Stock: 807815; Pricing: 1=0.1, 10=0.01, 25=0.0064, 50=0.0054, 100=0.0047, 250=0.00392, 500=0.00346, 1000=0.00304, 5000=0.0023 (USD); Mounting Technology: Surface Mount; Pins: 2; Package Shape: Rectangular; Case/Package: 0402; Terminal Finish: Nickel; Min Operating Temperature: -55°C; Max Operating Temperature: 155°C; JESD-609 Code: e3; Resistor Type: FIXED RESISTOR; Packaging: Tape and Reel; Value: 0R; Technology: METAL GLAZE/THICK FILM; Termination: Wraparound; Reach SVHC Compliant: Yes; RoHS Compliant: Yes; ComponentLink1URL: https://datasheet.ciiva.com:443/pdfs/VipMasterIC/IC/YAGO/YAGOS02562/YAGOS02562-1.pdf?src-supplier=IHS+Markit; ComponentLink1Description: https://datasheet.ciiva.com:443/pdfs/VipMasterIC/IC/YAGO/YAGOS02562/YAGOS02562-1.pdf?src-supplier=IHS+Markit; ComponentLink2URL: https://datasheet.ciiva.com/16790/pyu-rc0402-51-rohs-l-6-r-16790444.pdf?src-supplier=Future+Electronics; ComponentLink2Description: https://datasheet.ciiva.com/16790/pyu-rc0402-51-rohs-l-6-r-16790444.pdf?src-supplier=Future+Electronics; LCSC Part No.: C106231
R4 R5 R7 R8 = RC0402FR-0727RL: RES 27 OHM 1% 1/16W 0402; Manufacturer: Yageo; Additional Feature: LASER TRIMMABLE; Power: 62.5mW; Rated Temperature: 70°C; Working Voltage: 50V; Temperature Coefficient (ppm/Cel): 100; Package Height: 0.35mm; Package Length: 1mm; Package Width: 0.5mm; Supplier: Digikey; Supplier Part Number: YAG3086CT-ND; Manufacturer Part Number: RC0402FR-0727RL; RoHS: Yes; Category: Chip SMD Resistors; Stock: 69974; Pricing: 1=0.1, 10=0.007, 100=0.0061, 1000=0.00408, 2500=0.00357, 10000=0.00204 (USD); Mounting Technology: Surface Mount; Pins: 2; Package Shape: Rectangular; Case/Package: 0402; Terminal Finish: Nickel; Min Operating Temperature: -55°C; Max Operating Temperature: 155°C; Tolerance: 1%; JESD-609 Code: e3; Resistor Type: FIXED RESISTOR; Construction: Chip; Packaging: Tape and Reel; Value: 27R; Technology: METAL GLAZE/THICK FILM; Termination: Wraparound; Reach SVHC Compliant: Yes; RoHS Compliant: Yes; ComponentLink1URL: https://datasheet.ciiva.com:443/pdfs/VipMasterIC/IC/YAGO/YAGO-S-A0008145938/YAGO-S-A0008145938-1.pdf?src-supplier=IHS+Markit; ComponentLink1Description: https://datasheet.ciiva.com:443/pdfs/VipMasterIC/IC/YAGO/YAGO-S-A0008145938/YAGO-S-A0008145938-1.pdf?src-supplier=IHS+Markit; ComponentLink2URL: https://datasheet.ciiva.com/11808/0900766b80c66297-11808450.pdf?src-supplier=Rs; ComponentLink2Description: https://datasheet.ciiva.com/11808/0900766b80c66297-11808450.pdf?src-supplier=Rs; ComponentLink3URL: https://datasheet.ciiva.com/7849/1018594-7849927.pdf?src-supplier=Element14; ComponentLink3Description: https://datasheet.ciiva.com/7849/1018594-7849927.pdf?src-supplier=Element14; ComponentLink4URL: https://datasheet.ciiva.com/7849/1018594-7849926.pdf?src-supplier=Element14; ComponentLink4Description: https://datasheet.ciiva.com/7849/1018594-7849926.pdf?src-supplier=Element14; ComponentLink5URL: https://datasheet.ciiva.com/17044/pyu-rc0402-51-rohs-l-6-17044345.pdf?src-supplier=Future+Electronics; ComponentLink5Description: https://datasheet.ciiva.com/17044/pyu-rc0402-51-rohs-l-6-17044345.pdf?src-supplier=Future+Electronics; ComponentLink6URL: https://datasheet.ciiva.com/15189/getdatasheetpartid-327852-15189402.pdf?src-supplier=Verical; ComponentLink6Description: https://datasheet.ciiva.com/15189/getdatasheetpartid-327852-15189402.pdf?src-supplier=Verical; LCSC Part No.: C138021
R6 R12 R14 R24 R27 = AC0402FR-0710KL: RES SMD 10K OHM 1% 1/16W 0402; Manufacturer: Yageo Group; Max Power Dissipation: 63mW; Power Dissipation: 62.5mW; Value: 10kΩ; Temperature Coefficient: 100ppm/°C; Voltage Rating: 50V; Supplier: DigiKey; Supplier Part Number: YAG3436CT-ND; Manufacturer Part Number: AC0402FR-0710KL; RoHS: Compliant; Category: Chip SMD Resistors; Stock: 17398; Pricing: 1=0.1, 10=0.009, 100=0.0082, 1000=0.00612, 2500=0.0051, 10000=0.00204 (USD); Case/Package: 0402; Case Code (Imperial): 0402; Case Code (Metric): 1005; China RoHS: Non-Compliant; Composition: Thick Film; Depth: 500µm; Features: Automotive AEC-Q200, Moisture Resistant; Height: 320µm; Lead Free: Lead Free; Length: 990.6µm; Lifecycle Status: Production; Max Operating Temperature: 155°C; Military Standard: Not; Min Operating Temperature: -55°C; Mounting Technology: Surface Mount; Number of Terminals: 2; Number of Terminations: 2; Packaging: Tape & Reel; Power Rating: 62.5mW; REACH SVHC: Yes; Schedule B: 8533210045, 8533210045|8533210045|8533210045|8533210045|8533210045|8533210045|8533210045|8533210045|8533210045|8533210045|8533210045|8533210045|8533210045|8533210045|8533210045|8533210045|8533210045|8533210045|8533210045, 8533210045|8533210045|8533210045|8533210045|8533210045|8533210045|8533210045|8533210045|8533210045|8533210045|8533210045|8533210045|8533210045|8533210045|8533210045|8533210045|8533210045|8533210045|8533210045|8533210045|8533210045|8533210045|8533210045|85; Termination: SMD/SMT; Tolerance: 1%; Width: 500µm; Working Voltage: 50V; ComponentLink1URL: https://datasheet.octopart.com:443/AC0402FR-0710KL-Yageo-datasheet-182189377.pdf?src-supplier=IHS; ComponentLink1Description: https://datasheet.octopart.com:443/AC0402FR-0710KL-Yageo-datasheet-182189377.pdf?src-supplier=IHS; ComponentLink2URL: https://datasheet.octopart.com:443/AC0402FR-0710KL-Yageo-datasheet-83209224.pdf?src-supplier=Upverter; ComponentLink2Description: https://datasheet.octopart.com:443/AC0402FR-0710KL-Yageo-datasheet-83209224.pdf?src-supplier=Upverter; ComponentLink3URL: https://datasheet.octopart.com:443/AC0402FR-0710KL-Yageo-datasheet-178509465.pdf?src-supplier=Newark; ComponentLink3Description: https://datasheet.octopart.com:443/AC0402FR-0710KL-Yageo-datasheet-178509465.pdf?src-supplier=Newark; ComponentLink4URL: https://datasheet.octopart.com:443/AC0402FR-0710KL-Yageo-datasheet-166720450.pdf?src-supplier=JRH+Electronics; ComponentLink4Description: https://datasheet.octopart.com:443/AC0402FR-0710KL-Yageo-datasheet-166720450.pdf?src-supplier=JRH+Electronics; ComponentLink5URL: https://datasheet.octopart.com:443/AC0402FR-0710KL-Yageo-datasheet-151884373.pdf?src-supplier=Future+Electronics; ComponentLink5Description: https://datasheet.octopart.com:443/AC0402FR-0710KL-Yageo-datasheet-151884373.pdf?src-supplier=Future+Electronics; ComponentLink6URL: https://datasheet.octopart.com:443/AC0402FR-0710KL-Yageo-datasheet-137699919.pdf?src-supplier=Future+Electronics; ComponentLink6Description: https://datasheet.octopart.com:443/AC0402FR-0710KL-Yageo-datasheet-137699919.pdf?src-supplier=Future+Electronics; ComponentLink7URL: https://datasheet.octopart.com:443/AC0402FR-0710KL-Yageo-datasheet-24580492.pdf?src-supplier=Future+Electronics; ComponentLink7Description: https://datasheet.octopart.com:443/AC0402FR-0710KL-Yageo-datasheet-24580492.pdf?src-supplier=Future+Electronics; ComponentLink8URL: https://datasheet.octopart.com:443/AC0402FR-0710KL-Yageo-datasheet-13029202.pdf?src-supplier=Future+Electronics; ComponentLink8Description: https://datasheet.octopart.com:443/AC0402FR-0710KL-Yageo-datasheet-13029202.pdf?src-supplier=Future+Electronics; ComponentLink9URL: https://datasheet.octopart.com/AC0402FR-0710KL-Yageo-datasheet-12512238.pdf; ComponentLink9Description: https://datasheet.octopart.com/AC0402FR-0710KL-Yageo-datasheet-12512238.pdf; ComponentLink10URL: https://datasheet.octopart.com:443/AC0402FR-0710KL-Yageo-datasheet-128677448.pdf?src-supplier=X-ON; ComponentLink10Description: https://datasheet.octopart.com:443/AC0402FR-0710KL-Yageo-datasheet-128677448.pdf?src-supplier=X-ON; ComponentLink11URL: http://sigma.octopart.com:80/conflict_mineral_statement/Yageo-company-3.pdf?src-supplier=Compliance+Statements; ComponentLink11Description: http://sigma.octopart.com:80/conflict_mineral_statement/Yageo-company-3.pdf?src-supplier=Compliance+Statements; ComponentLink12URL: http://sigma.octopart.com:80/rohs_statement/Yageo-company-2.pdf?src-supplier=Compliance+Statements; ComponentLink12Description: http://sigma.octopart.com:80/rohs_statement/Yageo-company-2.pdf?src-supplier=Compliance+Statements; LCSC Part No.: C144807
R13 = RC0402FR-074K7L: RES 4.7K OHM 1% 1/16W 0402; Manufacturer: Yageo; Additional Feature: LASER TRIMMABLE; Power: 62.5mW; Rated Temperature: 70°C; Value: 4.7kR; Working Voltage: 50V; Temperature Coefficient (ppm/Cel): 100; Package Height: 0.35mm; Package Length: 1mm; Package Width: 0.5mm; Supplier: Digikey; Supplier Part Number: 311-4.7KLRCT-ND; Manufacturer Part Number: RC0402FR-074K7L; RoHS: Yes; Category: Chip SMD Resistors; Stock: 1919784; Pricing: 1=0.1, 10=0.02, 100=0.009, 1000=0.00474, 2500=0.00381, 5000=0.00328, 10000=0.00286, 20000=0.00253, 30000=0.00237, 50000=0.0022, 70000=0.0021, 100000=0.002, 250000=0.00181, 500000=0.0017, 1000000=0.00161 (USD); Mounting Technology: Surface Mount; Pins: 2; Package Shape: Rectangular; Case/Package: 0402; Terminal Finish: Nickel; Min Operating Temperature: -55°C; Max Operating Temperature: 155°C; Tolerance: 1%; JESD-609 Code: e3; Resistor Type: FIXED RESISTOR; Construction: Chip; Packaging: Tape and Reel; Technology: METAL GLAZE/THICK FILM; Termination: Wraparound; Reach SVHC Compliant: Yes; RoHS Compliant: Yes; ComponentLink1URL: https://datasheet.ciiva.com:443/pdfs/VipMasterIC/IC/YAGO/YAGO-S-A0008145938/YAGO-S-A0008145938-1.pdf?src-supplier=IHS+Markit; ComponentLink1Description: https://datasheet.ciiva.com:443/pdfs/VipMasterIC/IC/YAGO/YAGO-S-A0008145938/YAGO-S-A0008145938-1.pdf?src-supplier=IHS+Markit; ComponentLink2URL: https://datasheet.ciiva.com/22661/1686128-22661342.pdf?src-supplier=Element14; ComponentLink2Description: https://datasheet.ciiva.com/22661/1686128-22661342.pdf?src-supplier=Element14; ComponentLink3URL: https://datasheet.ciiva.com/7850/1018594-7850022.pdf?src-supplier=Element14; ComponentLink3Description: https://datasheet.ciiva.com/7850/1018594-7850022.pdf?src-supplier=Element14; ComponentLink4URL: https://datasheet.ciiva.com/7850/1018594-7850023.pdf?src-supplier=Element14; ComponentLink4Description: https://datasheet.ciiva.com/7850/1018594-7850023.pdf?src-supplier=Element14; LCSC Part No.: C105871
R19-R21 = RC0402FR-071KL: RES 1K OHM 1% 1/16W 0402; Manufacturer: Yageo; Additional Feature: LASER TRIMMABLE; Power: 62.5mW; Rated Temperature: 70°C; Value: 1kR; Working Voltage: 50V; Temperature Coefficient (ppm/Cel): 100; Package Height: 0.35mm; Package Length: 1mm; Package Width: 0.5mm; Supplier: Digikey; Supplier Part Number: 311-1.00KLRCT-ND; Manufacturer Part Number: RC0402FR-071KL; RoHS: Yes; Category: Chip SMD Resistors; Stock: 2395421; Pricing: 1=0.1, 10=0.007, 100=0.0061, 1000=0.0051, 2500=0.00408 (USD); Mounting Technology: Surface Mount; Pins: 2; Package Shape: Rectangular; Case/Package: 0402; Terminal Finish: Nickel; Min Operating Temperature: -55°C; Max Operating Temperature: 155°C; Tolerance: 1%; JESD-609 Code: e3; Resistor Type: FIXED RESISTOR; Construction: Chip; Packaging: Tape and Reel; Technology: METAL GLAZE/THICK FILM; Termination: Wraparound; Reach SVHC Compliant: Yes; RoHS Compliant: Yes; ComponentLink1URL: https://datasheet.ciiva.com:443/pdfs/VipMasterIC/IC/YAGO/YAGO-S-A0008145938/YAGO-S-A0008145938-1.pdf?src-supplier=IHS+Markit; ComponentLink1Description: https://datasheet.ciiva.com:443/pdfs/VipMasterIC/IC/YAGO/YAGO-S-A0008145938/YAGO-S-A0008145938-1.pdf?src-supplier=IHS+Markit; ComponentLink2URL: https://datasheet.ciiva.com/11819/0900766b80c66297-11819477.pdf?src-supplier=Rs; ComponentLink2Description: https://datasheet.ciiva.com/11819/0900766b80c66297-11819477.pdf?src-supplier=Rs; ComponentLink3URL: https://datasheet.ciiva.com/22747/1018594-22747513.pdf?src-supplier=Element14; ComponentLink3Description: https://datasheet.ciiva.com/22747/1018594-22747513.pdf?src-supplier=Element14; ComponentLink4URL: https://datasheet.ciiva.com/12666/pyu-rc0402-51-rohs-l-6-r-12666741.pdf?src-supplier=Mouser; ComponentLink4Description: https://datasheet.ciiva.com/12666/pyu-rc0402-51-rohs-l-6-r-12666741.pdf?src-supplier=Mouser; ComponentLink5URL: https://datasheet.ciiva.com/17063/pyu-rc0402-51-rohs-l-6-r-17063193.pdf?src-supplier=Future+Electronics; ComponentLink5Description: https://datasheet.ciiva.com/17063/pyu-rc0402-51-rohs-l-6-r-17063193.pdf?src-supplier=Future+Electronics; LCSC Part No.: C106235
R22 R23 R25 R26 = AC0402FR-075K1L: RES SMD 5.1K OHM 1% 1/16W 0402; Manufacturer: Yageo; Additional Feature: LASER TRIMMABLE; Power: 62.5mW; Rated Temperature: 70°C; Value: 5.1kR; Working Voltage: 50V; Temperature Coefficient (ppm/Cel): 100; Package Height: 0.32mm; Package Length: 1mm; Package Width: 0.5mm; Reference Standard: AEC-Q200; Supplier: Avnet; Supplier Part Number: AC0402FR-075K1L; Manufacturer Part Number: AC0402FR-075K1L; RoHS: Yes; Category: Chip SMD Resistors; Stock: 10000; Pricing: 10000=0.00119, 20000=0.00117, 40000=0.00114, 60000=0.00112, 80000=0.0011 (USD); Mounting Technology: Surface Mount; Pins: 2; Package Shape: Rectangular; Case/Package: 0402; Terminal Finish: Nickel; Min Operating Temperature: -55°C; Max Operating Temperature: 155°C; Tolerance: 1%; JESD-609 Code: e3; Resistor Type: FIXED RESISTOR; Construction: Chip; Packaging: Tape and Reel; Technology: METAL GLAZE/THICK FILM; Termination: Wraparound; Reach SVHC Compliant: Yes; RoHS Compliant: Yes; ComponentLink1URL: https://datasheet.ciiva.com:443/pdfs/VipMasterIC/IC/YAGO/YAGO-S-A0003597364/YAGO-S-A0003597364-1.pdf?src-supplier=IHS+Markit; ComponentLink1Description: https://datasheet.ciiva.com:443/pdfs/VipMasterIC/IC/YAGO/YAGO-S-A0003597364/YAGO-S-A0003597364-1.pdf?src-supplier=IHS+Markit; ComponentLink2URL: https://datasheet.octopart.com/AC0402FR-075K1L-Yageo-datasheet-166720450.pdf?src-supplier=Future+Electronics; ComponentLink2Description: https://datasheet.octopart.com/AC0402FR-075K1L-Yageo-datasheet-166720450.pdf?src-supplier=Future+Electronics; ComponentLink3URL: http://www.yageo.com/documents/recent/PYu-AC_51_RoHS_L_2_revised.pdf?src-supplier=Future+Electronics; ComponentLink3Description: http://www.yageo.com/documents/recent/PYu-AC_51_RoHS_L_2_revised.pdf?src-supplier=Future+Electronics; ComponentLink4URL: http://www.yageo.com/NewPortal/yageodocoutput?fileName=/pdf/R-Chip/PYu-AC_51_RoHS_L_6.pdf&src-supplier=Digikey; ComponentLink4Description: http://www.yageo.com/NewPortal/yageodocoutput?fileName=/pdf/R-Chip/PYu-AC_51_RoHS_L_6.pdf&src-supplier=Digikey; ComponentLink5URL: https://datasheet.octopart.com/AC0402FR-075K1L-Yageo-datasheet-178509465.pdf?src-supplier=Newark; ComponentLink5Description: https://datasheet.octopart.com/AC0402FR-075K1L-Yageo-datasheet-178509465.pdf?src-supplier=Newark; LCSC Part No.: C144745
SW1 SW2 = PTS645SH50SMTR92LFS: SWITCH TACTILE SPST-NO 0.05A 12V; Manufacturer: C&K Components; Actuator Material: Nylon, Polyamide; Contact Current Rating: 50mA; Contact Resistance: 100mΩ; Electrical Life: 100kcycles; Illumination Type: Illuminated, Non-Illuminated; Insulation Resistance: 100GΩ; Number of Positions: 1; Operating Force: 1.96N; Switch Function: Off-Mom; Throw Configuration: SPST; Supplier: DigiKey; Supplier Part Number: CKN9085CT-ND; Manufacturer Part Number: PTS645SH50SMTR92LFS; RoHS: Compliant; Category: Tactile Switches; Stock: 18074; Pricing: 1=0.35, 10=0.3, 25=0.2804, 100=0.251, 250=0.23256, 500=0.21948 (USD); Case/Package: SMD/SMT; Color: Black; Contact Material: Bronze; Contact Plating: Silver; Current Rating: 50mA; Depth: 9mm; Height: 3.4544mm; Lead Free: Lead Free; Length: 6mm; Life (Cycles): 100kcycles; Lifecycle Status: Production; Max Current Rating: 50mA; Max Operating Temperature: 60°C; Max Voltage Rating (DC): 12V; Mechanical Life: 100kcycles; Min Operating Temperature: -20°C; Mounting Technology: Surface Mount; Orientation: Straight; Packaging: Tape & Reel (TR); REACH SVHC: Yes; Termination: Gull Wing; Voltage Rating (DC): 12V; ComponentLink1URL: https://datasheet.octopart.com:443/PTS645SH50SMTR92LFS-C%26K-Components-datasheet-169841344.pdf?src-supplier=Farnell; ComponentLink1Description: https://datasheet.octopart.com:443/PTS645SH50SMTR92LFS-C%26K-Components-datasheet-169841344.pdf?src-supplier=Farnell; ComponentLink2URL: https://datasheet.octopart.com:443/PTS645SH50SMTR92LFS-C%26K-Components-datasheet-165782998.pdf?src-supplier=Farnell; ComponentLink2Description: https://datasheet.octopart.com:443/PTS645SH50SMTR92LFS-C%26K-Components-datasheet-165782998.pdf?src-supplier=Farnell; ComponentLink3URL: https://datasheet.octopart.com:443/PTS645SH50SMTR92LFS-C%26K-Components-datasheet-67873720.pdf?src-supplier=Upverter; ComponentLink3Description: https://datasheet.octopart.com:443/PTS645SH50SMTR92LFS-C%26K-Components-datasheet-67873720.pdf?src-supplier=Upverter; ComponentLink4URL: https://datasheet.octopart.com:443/PTS645SH50SMTR92-LFS-C%26K-Components-datasheet-141421486.pdf?src-supplier=Upverter; ComponentLink4Description: https://datasheet.octopart.com:443/PTS645SH50SMTR92-LFS-C%26K-Components-datasheet-141421486.pdf?src-supplier=Upverter; ComponentLink5URL: https://datasheet.octopart.com:443/PTS645SH50SMTR92-LFS-C%26K-Components-datasheet-110647872.pdf?src-supplier=TME; ComponentLink5Description: https://datasheet.octopart.com:443/PTS645SH50SMTR92-LFS-C%26K-Components-datasheet-110647872.pdf?src-supplier=TME; ComponentLink6URL: https://datasheet.octopart.com:443/PTS645SH50SMTR-92-LFS-C%26K-Components-datasheet-150821959.pdf?src-supplier=TME; ComponentLink6Description: https://datasheet.octopart.com:443/PTS645SH50SMTR-92-LFS-C%26K-Components-datasheet-150821959.pdf?src-supplier=TME; ComponentLink7URL: https://datasheet.octopart.com:443/PTS645SH50SMTR92LFS-C%26K-Components-datasheet-138128951.pdf?src-supplier=Future+Electronics; ComponentLink7Description: https://datasheet.octopart.com:443/PTS645SH50SMTR92LFS-C%26K-Components-datasheet-138128951.pdf?src-supplier=Future+Electronics; ComponentLink8URL: https://datasheet.octopart.com:443/PTS645SH50SMTR92LFS-C%26K-Components-datasheet-62111174.pdf?src-supplier=Future+Electronics; ComponentLink8Description: https://datasheet.octopart.com:443/PTS645SH50SMTR92LFS-C%26K-Components-datasheet-62111174.pdf?src-supplier=Future+Electronics; ComponentLink9URL: https://datasheet.octopart.com:443/PTS645SH50SMTR92LFS-C%26K-Components-datasheet-24578962.pdf?src-supplier=Future+Electronics; ComponentLink9Description: https://datasheet.octopart.com:443/PTS645SH50SMTR92LFS-C%26K-Components-datasheet-24578962.pdf?src-supplier=Future+Electronics; ComponentLink10URL: https://datasheet.octopart.com:443/PTS645SH50SMTR92-LFS-C%26K-Components-datasheet-12590747.pdf?src-supplier=Future+Electronics; ComponentLink10Description: https://datasheet.octopart.com:443/PTS645SH50SMTR92-LFS-C%26K-Components-datasheet-12590747.pdf?src-supplier=Future+Electronics; LCSC Part No.: C2799018
U1 = ESP32-S3-MINI-1-N8: SMD module, ESP32-S3FN8, 8 MB SPI flash, PCB antenna; Manufacturer: Espressif Systems; Supplier: Digikey; Supplier Part Number: 5407-ESP32-S3-MINI-1-N8CT-ND; Manufacturer Part Number: ESP32-S3-MINI-1-N8; RoHS: No; Category: LDO; Pricing: 1=5.28, 10=4.566, 25=4.3196, 100=3.9802, 250=3.7768, 650=3.58103, 1300=3.44874, 1950=3.37497 (USD); ComponentLink1URL: https://datasheet.octopart.com/ESP32-S3-MINI-1-N8-Espressif-Systems-datasheet-188867343.pdf?src-supplier=TME; ComponentLink1Description: https://datasheet.octopart.com/ESP32-S3-MINI-1-N8-Espressif-Systems-datasheet-188867343.pdf?src-supplier=TME; LCSC Part No.: C2913206
U2 = FT231XQ-R: IC USB SERIAL FULL UART 20QFN; Manufacturer: FTDI; Power Supplies: 3.3/5V; Max Supply Current: 8.4mA; Max Supply Voltage: 5.5V; Min Supply Voltage: 2.97V; Nominal Supply Voltage: 5V; Qualification Status: Not Qualified; Supplier: Digikey; Supplier Part Number: 768-1128-1-ND; Manufacturer Part Number: FT231XQ-R; RoHS: Yes; Category: Interface ICs; Stock: 12588; Pricing: 1=2.34, 25=2.27, 100=2.2, 250=2, 500=1.82002, 1000=1.7625, 5000=1.6779 (USD); Case/Package: HVQCCN; Pins: 20; Package Shape: Square; Min Operating Temperature: -40°C; Max Operating Temperature: 85°C; JESD-30 Code: S-XQCC-N20; Package Style: CHIP CARRIER, HEAT SINK/SLUG, VERY THIN PROFILEMeter; Surface Mount: Yes; Technology: CMOS; Terminal Form: No Lead; Terminal Position: QUAD; Length: 4mm; Width: 4mm; Height - Seated (Max): 0.8mm; Terminal Pitch: 0.5mm; Temperature Grade: INDUSTRIAL; Reach SVHC Compliant: Yes; RoHS Compliant: Yes; ComponentLink1URL: https://datasheet.ciiva.com:443/pdfs/VipMasterIC/IC/FTDI/FTDIS00099/FTDIS00099-1.pdf?src-supplier=IHS+Markit; ComponentLink1Description: https://datasheet.ciiva.com:443/pdfs/VipMasterIC/IC/FTDI/FTDIS00099/FTDIS00099-1.pdf?src-supplier=IHS+Markit; ComponentLink2URL: https://datasheet.ciiva.com/1787/ds-ft231x-1787312.pdf?src-supplier=Digikey; ComponentLink2Description: https://datasheet.ciiva.com/1787/ds-ft231x-1787312.pdf?src-supplier=Digikey; ComponentLink3URL: https://datasheet.ciiva.com/4787/ds-ft231x-13571-4787570.pdf?src-supplier=Mouser; ComponentLink3Description: https://datasheet.ciiva.com/4787/ds-ft231x-13571-4787570.pdf?src-supplier=Mouser; ComponentLink4URL: https://datasheet.ciiva.com/30475/0900766b811020d3-30475405.pdf?src-supplier=Rs; ComponentLink4Description: https://datasheet.ciiva.com/30475/0900766b811020d3-30475405.pdf?src-supplier=Rs; ComponentLink5URL: https://datasheet.ciiva.com/1787/ft-x-series-1787313.pdf?src-supplier=Digikey; ComponentLink5Description: https://datasheet.ciiva.com/1787/ft-x-series-1787313.pdf?src-supplier=Digikey; ComponentLink6URL: https://datasheet.ciiva.com/1787/ft-x-series-1787314.pdf?src-supplier=Digikey; ComponentLink6Description: https://datasheet.ciiva.com/1787/ft-x-series-1787314.pdf?src-supplier=Digikey; LCSC Part No.: C132159
U3 = TL1963A-33DCYR: IC REG LIN 3.3V 1.5A SOT-223-4; Manufacturer: Texas Instruments; Package Body Material: Plastic; Adjustability: FIXED; Dropout Voltage1-Max: 550mV; Dropout Voltage1-Nom: 340mV; Input Voltage Absolute-Max: 20V; Min Input Voltage: 3.8V; Channels: 1; Output Voltage1-Max: 3.4V; Output Voltage1-Min: 3.2V; Regulator Type: FIXED POSITIVE SINGLE OUTPUT LDO REGULATOR; Voltage Tolerance-Max: 3%; Qualification Status: Not Qualified; Supplier: Digikey; Supplier Part Number: 296-24897-1-ND; Manufacturer Part Number: TL1963A-33DCYR; RoHS: Yes; Category: Voltage Regulators - Linear; Stock: 5278; Pricing: 1=2.76, 10=2.06, 25=1.8848, 100=1.6922, 250=1.60032, 500=1.54492, 1000=1.49932, 2500=1.45085, 5000=1.42184 (USD); Case/Package: SOP; Pins: 4; Package Shape: Rectangular; Terminal Finish: Tin; JESD-609 Code: e3; Max Supply Voltage: 20V; JESD-30 Code: R-PDSO-G4; Moisture Sensitivity Level: 2; Number of Outputs: 1; Operating Temperature, TJ-Max: 125°C; Operating Temperature, TJ-Min: -40°C; Output Current1-Max: 1.5A; Output Voltage1-Nom: 3.3V; Packaging: Tape and Reel; Peak Reflow Temperature (Cel): 260°C; Surface Mount: Yes; Technology: BIPOLAR; Terminal Form: Gull Wing; Terminal Position: DUAL; Length: 6.5mm; Width: 3.5mm; Height - Seated (Max): 1.8mm; Terminal Pitch: 2.3mm; Reach SVHC Compliant: Yes; RoHS Compliant: Yes; ComponentLink1URL: https://www.ti.com:443/lit/ds/symlink/tl1963a.pdf?src-supplier=IHS+Markit; ComponentLink1Description: https://www.ti.com:443/lit/ds/symlink/tl1963a.pdf?src-supplier=IHS+Markit; ComponentLink2URL: https://datasheet.ciiva.com/2046/-2046068.pdf?src-supplier=Digikey; ComponentLink2Description: https://datasheet.ciiva.com/2046/-2046068.pdf?src-supplier=Digikey; LCSC Part No.: C181262

## Assembly variants
Prototype: not fitted C5 C10 R2 R3 R12 R15 R16